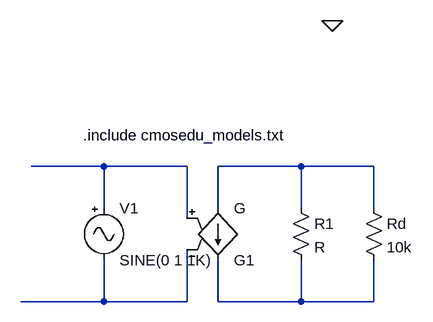
[diagram p0: schematic Parte5.asc]
Parte5.asc, the LTspice schematic file:
Version 4
SHEET 1 880 680
WIRE -208 16 -320 16
WIRE -80 16 -208 16
WIRE 96 16 -32 16
WIRE 208 16 96 16
WIRE -208 80 -208 16
WIRE -32 80 -32 16
WIRE 96 80 96 16
WIRE 208 80 208 16
WIRE -80 96 -80 16
WIRE -208 224 -208 160
WIRE -208 224 -336 224
WIRE -80 224 -80 144
WIRE -80 224 -208 224
WIRE -32 224 -32 160
WIRE 96 224 96 160
WIRE 96 224 -32 224
WIRE 208 224 208 160
WIRE 208 224 96 224
FLAG 144 -208 0
SYMBOL res 192 64 R0
SYMATTR InstName Rd
SYMATTR Value 10k
SYMBOL Misc\\signal -208 64 R0
SYMATTR InstName V1
SYMBOL g2 -32 176 M180
SYMATTR InstName G1
SYMBOL res 80 64 R0
SYMATTR InstName R1
TEXT -240 -32 Left 2 !.include cmosedu_models.txt

The netlist it stands for:
* Parte5.asc
Rd N002 N004 10k
V1 N001 N003 SINE(0 1 1K)
G1 N002 N004 N001 N003 G
R1 N002 N004 R
.include cmosedu_models.txt
.backanno
.end